# Altium project AXON-UPS.PrjPcb
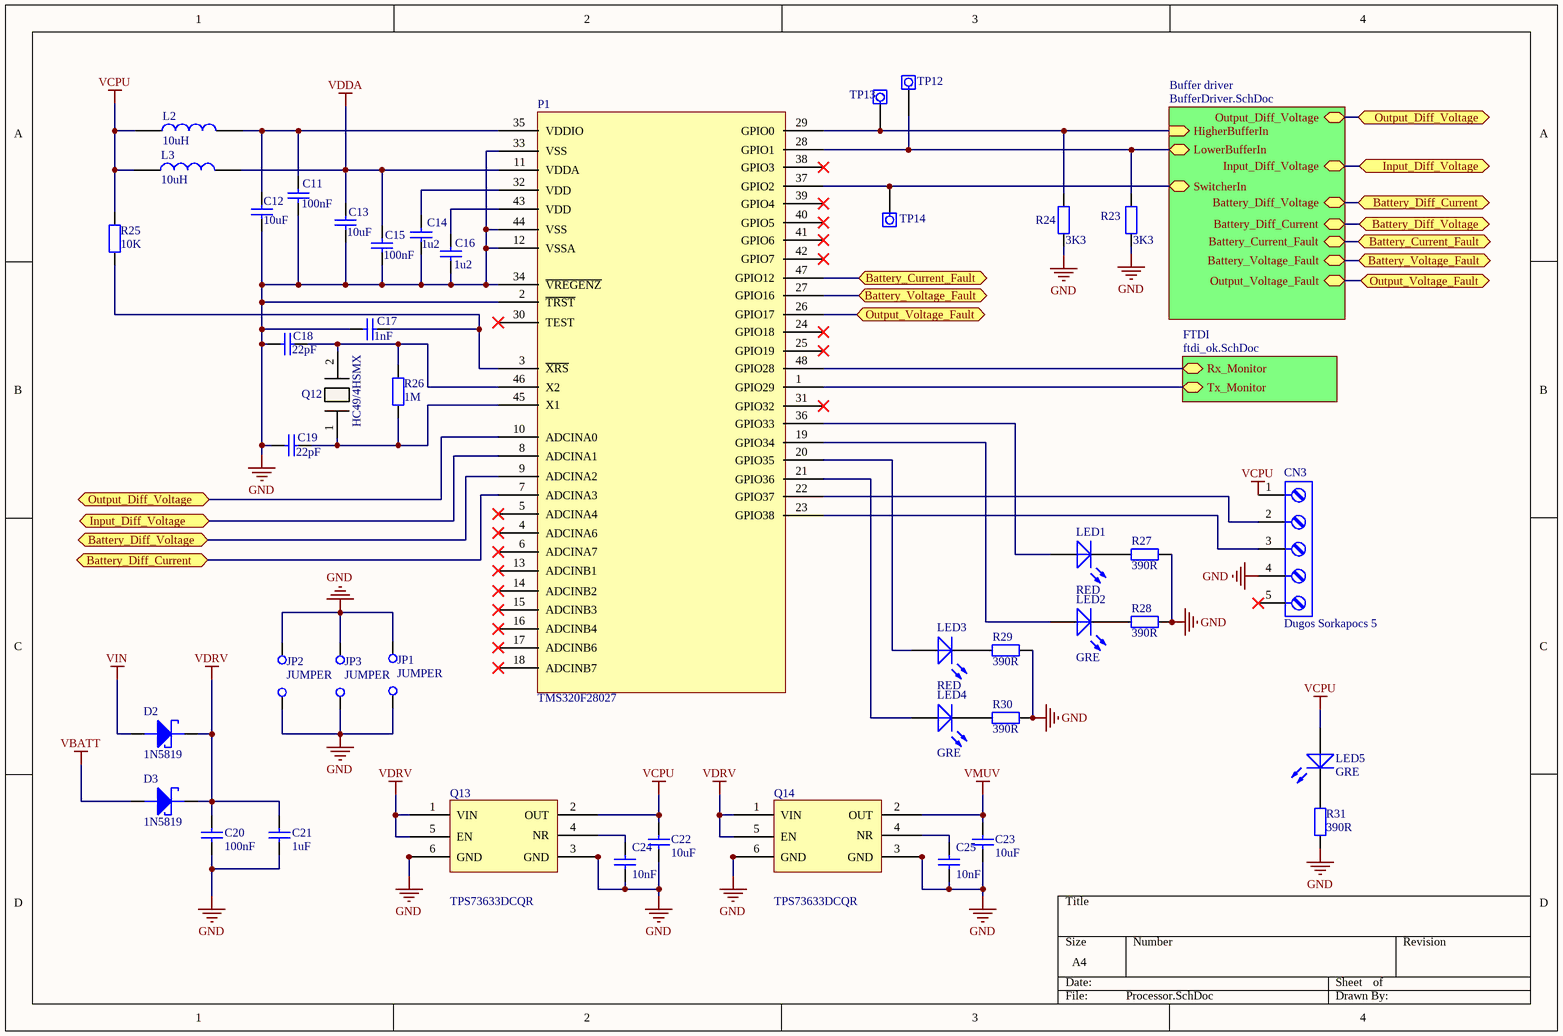
[diagram p0: Processor.SchDoc]
6 sheets, 186 parts. Net scope: hierarchical (ports join the sheet entries above them; power ports are global).
Board file: UPS.PcbDoc
Sheets:
  Processor.SchDoc
    Buffer driver = BufferDriver.SchDoc
      Fet meghajtó = FetController.SchDoc
        Főkör = UPS_controller.SchDoc
          Mérések = Measurements.SchDoc
    FTDI = ftdi_ok.SchDoc

## Sheet Processor.SchDoc
size A4; DocumentNumber: 4; SheetNumber: 4; SheetTotal: 6

### Parts
C11  100nF  [FP_0805_CAP_085]
C12  10uF  [FP_0805_CAP_085]
C13  10uF  [FP_0805_CAP_085]
C14  1u2  [FP_1206_CAP_125]
C15  100nF  [FP_0805_CAP_085]
C16  1u2  [FP_1206_CAP_125]
C17  1nF  [FP_0805_CAP_085]
C18  22pF  [FP_0805_CAP_085]
C19  22pF  [FP_0805_CAP_085]
C20  100nF  [FP_0805_CAP_085]
C21  1uF  [FP_0805_CAP_085]
C22  10uF  [FP_0805_CAP_085]
C23  10uF  [FP_0805_CAP_085]
C24  10nF  [FP_0805_CAP_085]
C25  10nF  [FP_0805_CAP_085]
CN3  Dugos Sorkapocs 5  [FP_CONN4_TUSKE_254MM]
D2  1N5819  [AXIAL-0.3]
D3  1N5819  [AXIAL-0.3]
JP1  JUMPER  [FP_CONN2_TUSKE_254MM]
JP2  JUMPER  [FP_CONN2_TUSKE_254MM]
JP3  JUMPER  [FP_CONN2_TUSKE_254MM]
L2  10uH  [AXIAL-0.3]
L3  10uH  [AXIAL-0.3]
LED1  RED  [FP_LED_TH_RED]
LED2  GRE  [FP_LED_TH_GREEN]
LED3  RED  [FP_LED_TH_RED]
LED4  GRE  [FP_LED_TH_GREEN]
LED5  GRE  [FP_LED_TH_GREEN]
P1  TMS320F28027  [S-PQFP48]
Q12  HC49/4HSMX  [Crystal_10MHz]
Q13  TPS73633DCQR  [TPS73633]
Q14  TPS73633DCQR  [TPS73633]
R23  3K3  [FP_0805_RES]
R24  3K3  [FP_0805_RES]
R25  10K  [FP_0805_RES]
R26  1M  [FP_0805_RES]
R27  390R  [AXIAL-0.3]
R28  390R  [AXIAL-0.3]
R29  390R  [AXIAL-0.3]
R30  390R  [AXIAL-0.3]
R31  390R  [AXIAL-0.3]
TP12  Testpoint  [TESTPOINT_1.5]  (value not drawn)  (no BOM)
TP13  Testpoint  [TESTPOINT_1.5]  (value not drawn)  (no BOM)
TP14  Testpoint  [TESTPOINT_1.5]  (value not drawn)  (no BOM)

### Sub-sheets
Buffer driver = BufferDriver.SchDoc: HigherBufferIn (in), LowerBufferIn (bidir), SwitcherIn, Output_Diff_Voltage, Input_Diff_Voltage, Battery_Diff_Voltage, Battery_Diff_Current, Battery_Current_Fault, Battery_Voltage_Fault, Output_Voltage_Fault
FTDI = ftdi_ok.SchDoc: Rx_Monitor, Tx_Monitor

### Ports
Battery_Current_Fault, Battery_Diff_Current, Battery_Diff_Voltage, Battery_Voltage_Fault, Input_Diff_Voltage, Output_Diff_Voltage, Output_Voltage_Fault

### Nets
GND: C11.1 C12.1 C13.1 C14.1 C15.2 C16.1 C17.1 C18.1 C19.1 C20.1 C21.1 C22.1 C23.1 C24.1 C25.1 CN3.4 JP1.1(C1) JP1.2(C2) JP2.1(C1) JP2.2(C2) JP3.1(C1) JP3.2(C2) P1.2(~{TRST}) P1.12(VSSA) P1.33(VSS) P1.34(~{VREGENZ}) P1.44(VSS) Q13.3(GND) Q13.6(GND) Q14.3(GND) Q14.6(GND) R23.2 R24.1 R27.1 R28.1 R29.1 R30.1 R31.1
VBATT: D3.2(ANODE)
VCPU: C22.2 CN3.1 L2.1 L3.1 LED5.1(A) Q13.2(OUT) R25.2
VDDA: C13.2 C15.1 L3.2 P1.11(VDDA)
VDRV: C20.2 C21.2 D2.1(CATHODE) D3.1(CATHODE) Q13.1(VIN) Q13.5(EN) Q14.1(VIN) Q14.5(EN)
VIN: D2.2(ANODE)
VMUV: C23.2 Q14.2(OUT)
NetC11_2: C11.2 C12.2 L2.2 P1.35(VDDIO)
NetC14_2: C14.2 P1.32(VDD)
NetC16_2: C16.2 P1.43(VDD)
NetC17_2: C17.2 P1.3(~{XRS}) R25.1
NetC18_2: C18.2 P1.46(X2) Q12.2(X2) R26.2
NetC19_2: C19.2 P1.45(X1) Q12.1(X1) R26.1
NetC24_2: C24.2 Q13.4(NR)
NetC25_2: C25.2 Q14.4(NR)
NetC40_2: P1.10(ADCINA0) ; port Output_Diff_Voltage, sheet Buffer driver/Output_Diff_Voltage
NetC41_2: P1.9(ADCINA2) ; port Battery_Diff_Voltage, sheet Buffer driver/Battery_Diff_Current
NetC50_2: P1.8(ADCINA1) ; port Input_Diff_Voltage, sheet Buffer driver/Input_Diff_Voltage
NetC51_2: P1.7(ADCINA3) ; port Battery_Diff_Current, sheet Buffer driver/Battery_Diff_Voltage
NetCN3_2: CN3.2 P1.22(GPIO37)
NetCN3_3: CN3.3 P1.23(GPIO38)
NetLED1_1: LED1.1(A) P1.36(GPIO33)
NetLED1_2: LED1.2(K) R27.2
NetLED2_1: LED2.1(A) P1.19(GPIO34)
NetLED2_2: LED2.2(K) R28.2
NetLED3_1: LED3.1(A) P1.20(GPIO35)
NetLED3_2: LED3.2(K) R29.2
NetLED4_1: LED4.1(A) P1.21(GPIO36)
NetLED4_2: LED4.2(K) R30.2
NetLED5_2: LED5.2(K) R31.2
NetP1_1: P1.1(GPIO29) ; sheet FTDI/Tx_Monitor
NetP1_26: P1.26(GPIO17) ; port Output_Voltage_Fault, sheet Buffer driver/Output_Voltage_Fault
NetP1_27: P1.27(GPIO16) ; port Battery_Voltage_Fault, sheet Buffer driver/Battery_Voltage_Fault
NetP1_28: P1.28(GPIO1) R23.1 TP12.1 ; sheet Buffer driver/LowerBufferIn
NetP1_29: P1.29(GPIO0) R24.2 TP13.1 ; sheet Buffer driver/HigherBufferIn
NetP1_37: P1.37(GPIO2) TP14.1 ; sheet Buffer driver/SwitcherIn
NetP1_47: P1.47(GPIO12) ; port Battery_Current_Fault, sheet Buffer driver/Battery_Current_Fault
NetP1_48: P1.48(GPIO28) ; sheet FTDI/Rx_Monitor

Not connected (* = marked no-connect by the designer): CN3 5*; P1 4(ADCINA6)* 5(ADCINA4)* 6(ADCINA7)* 13(ADCINB1)* 14(ADCINB2)* 15(ADCINB3)* 16(ADCINB4)* 17(ADCINB6)* 18(ADCINB7)* 24(GPIO18)* 25(GPIO19)* 30(TEST)* 31(GPIO32)* 38(GPIO3)* 39(GPIO4)* 40(GPIO5)* 41(GPIO6)* 42(GPIO7)*

### Library data of the parts
C11-C25 = CAP: Capacitor
  C11 C15 C20: Value: 100nF; Lomex NR: 82-07-32
  C12 C13 C22 C23: Value: 10uF; Lomex NR: 82-08-32
  C14 C16: Value: 1u2; Lomex NR: 82-05-93
  C17: Value: 1nF; Lomex NR: 82-00-75
  C18 C19: Value: 22pF; Lomex NR: 82-09-18
  C21: Value: 1uF; Lomex NR: 82-05-11
  C24 C25: Value: 10nF; Lomex NR: 82-05-66
CN3 = Dugos Sorkapocs 5: SORKAPOCS 5 P RM5.08 CSAPSORLÉC 90° ZÁRT 12A; Part Class: Connector; K_manufacturer: (STE); Order Code: 43-07-79, 43-07-78; CompType: CPM5.08/5SQ, CPF5.08/5; Value: 5P; Distributor: Lomex; Package: RM5.08
D2 D3 = SCHOTTKY: NXP - PMEG3020EJ,115 - SCHOTTKY RECT 30V 2A SOD323F; Supplier: 16-04-12; Type: 1N5819
JP1-JP3 = JUMPER: Jumper Wire; Supplier: Farnell 1668537×1/6
L2 L3 = IND: Inductor; Value: 10uH; Lomex NR: 55-00-65
LED1 LED3 = LED: Part Class: Semiconductor; K_Manufacturer: Kingbright; CompType: KP-3216SRD-PRV; Distributor: Lomex; Order Code: 95-00-28; Package: 1206; Value: RED
LED2 LED4 LED5 = LED: Part Class: Semiconductor; K_Manufacturer: Kingbright; CompType: KP-3216SGD; Distributor: Lomex; Order Code: 95-00-26; Package: 1206; Value: GRE
P1 = TMS320F28027: Processor
Q12 = HC49/4HSMX: kristály
Q13 Q14 = TPS73633DCQR: proci táp 3V3
R23-R26 = RES: Resistor
  R23 R24: Value: 3K3
  R25: Value: 10K
  R26: Value: 1M
R27-R31 = Resistor: K_Manufacturer: Viking Tech Corp.; CompType: CR-05JL7--390R; Distributor: Lomex; Order Code: 81-10-82; Package: 0805; Part Class: Resistor; Value: 390R
TP12-TP14 = Testpoint: Part Class: Connector

## Sheet BufferDriver.SchDoc
size A4; DocumentNumber: 3; SheetNumber: 3; SheetTotal: 6
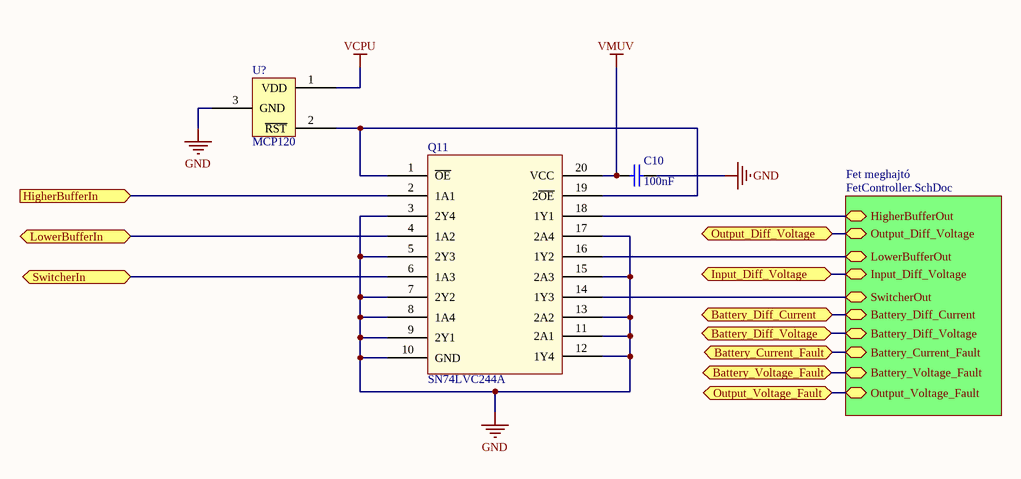
[diagram p1: BufferDriver.SchDoc]

### Parts
C10  100nF  [FP_0805_CAP_085]
Q11  SN74LVC244A  [SOP20]
U?  MCP120  [SOT-23 - 3]

### Sub-sheets
Fet meghajtó = FetController.SchDoc: HigherBufferOut, LowerBufferOut, SwitcherOut, Output_Diff_Voltage, Input_Diff_Voltage, Battery_Diff_Voltage, Battery_Diff_Current, Battery_Current_Fault, Battery_Voltage_Fault, Output_Voltage_Fault

### Ports
Battery_Current_Fault, Battery_Diff_Current, Battery_Diff_Voltage, Battery_Voltage_Fault, HigherBufferIn (in), Input_Diff_Voltage, LowerBufferIn (bidir), Output_Diff_Voltage, Output_Voltage_Fault, SwitcherIn

### Nets
GND: C10.1 Q11.3(2Y4) Q11.5(2Y3) Q11.7(2Y2) Q11.8(1A4) Q11.9(2Y1) Q11.10(GND) Q11.11(2A1) Q11.12(1Y4) Q11.13(2A2) Q11.15(2A3) Q11.17(2A4) U?.3(GND)
VCPU: U?.1(VDD)
VMUV: C10.2 Q11.20(VCC)
NetC40_2: port Output_Diff_Voltage, sheet Fet meghajtó/Output_Diff_Voltage
NetC41_2: port Battery_Diff_Current, sheet Fet meghajtó/Battery_Diff_Current
NetC50_2: port Input_Diff_Voltage, sheet Fet meghajtó/Input_Diff_Voltage
NetC51_2: port Battery_Diff_Voltage, sheet Fet meghajtó/Battery_Diff_Voltage
NetP1_26: port Output_Voltage_Fault, sheet Fet meghajtó/Output_Voltage_Fault
NetP1_27: port Battery_Voltage_Fault, sheet Fet meghajtó/Battery_Voltage_Fault
NetP1_28: Q11.4(1A2) ; port LowerBufferIn
NetP1_29: Q11.2(1A1) ; port HigherBufferIn
NetP1_37: Q11.6(1A3) ; port SwitcherIn
NetP1_47: port Battery_Current_Fault, sheet Fet meghajtó/Battery_Current_Fault
NetQ11_1: Q11.1(~{OE}) Q11.19(2~{OE}) U?.2(~{RST})
NetQ11_14: Q11.14(1Y3) ; sheet Fet meghajtó/SwitcherOut
NetQ11_16: Q11.16(1Y2) ; sheet Fet meghajtó/LowerBufferOut
NetQ11_18: Q11.18(1Y1) ; sheet Fet meghajtó/HigherBufferOut

### Library data of the parts
C10 = CAP: Capacitor; Value: 100nF; Lomex NR: 82-07-32
U? = MCP120: Voltage detector

## Sheet FetController.SchDoc
size A4; DocumentNumber: 2; SheetNumber: 2; SheetTotal: 6
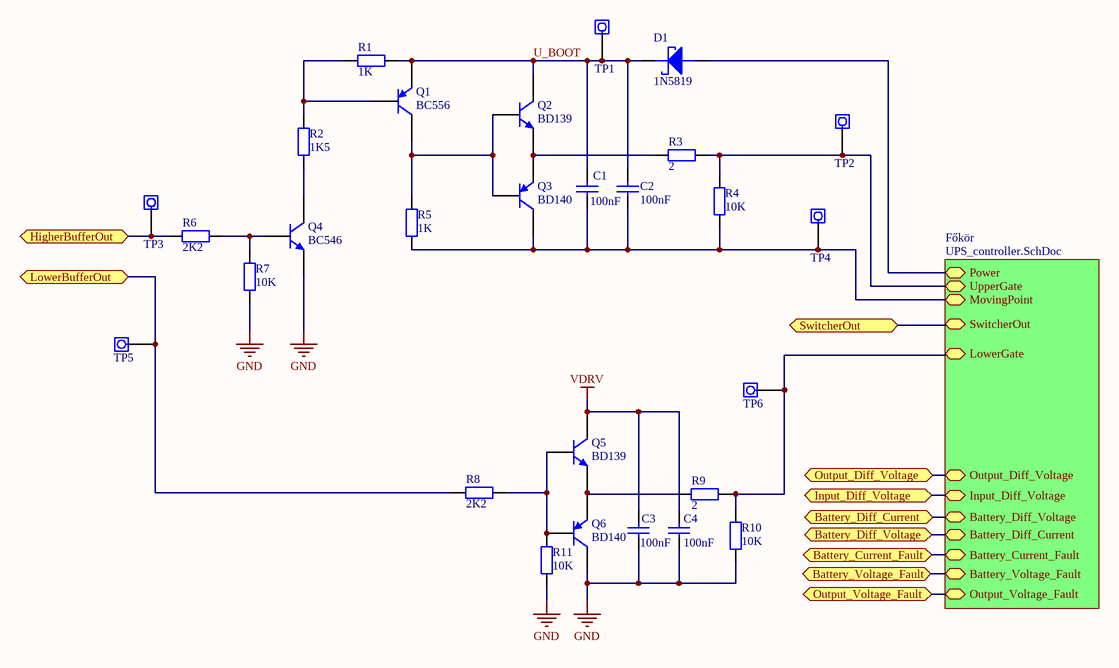
[diagram p2: FetController.SchDoc]

### Parts
C1  100nF  [FP_0805_CAP_085]
C2  100nF  [FP_0805_CAP_085]
C3  100nF  [FP_0805_CAP_085]
C4  100nF  [FP_0805_CAP_085]
D1  1N5819  [AXIAL-0.3]
Q1  BC556  [TO-92]
Q2  BD139  [TO-32]
Q3  BD140  [TO-32]
Q4  BC546  [TO-92]
Q5  BD139  [TO-32]
Q6  BD140  [TO-32]
R1  1K  [AXIAL-0.3]
R2  1K5  [AXIAL-0.3]
R3  2  [AXIAL-0.3]
R4  10K  [AXIAL-0.3]
R5  1K  [AXIAL-0.3]
R6  2K2  [AXIAL-0.3]
R7  10K  [AXIAL-0.3]
R8  2K2  [AXIAL-0.3]
R9  2  [AXIAL-0.3]
R10  10K  [AXIAL-0.3]
R11  10K  [AXIAL-0.3]
TP1  Testpoint  [TESTPOINT_1.5]  (value not drawn)  (no BOM)
TP2  Testpoint  [TESTPOINT_1.5]  (value not drawn)  (no BOM)
TP3  Testpoint  [TESTPOINT_1.5]  (value not drawn)  (no BOM)
TP4  Testpoint  [TESTPOINT_1.5]  (value not drawn)  (no BOM)
TP5  Testpoint  [TESTPOINT_1.5]  (value not drawn)  (no BOM)
TP6  Testpoint  [TESTPOINT_1.5]  (value not drawn)  (no BOM)

### Sub-sheets
Főkör = UPS_controller.SchDoc: Power, MovingPoint, UpperGate, LowerGate, SwitcherOut, Output_Diff_Voltage, Input_Diff_Voltage, Battery_Diff_Voltage, Battery_Diff_Current, Battery_Current_Fault, Battery_Voltage_Fault, Output_Voltage_Fault

### Ports
Battery_Current_Fault, Battery_Diff_Current, Battery_Diff_Voltage, Battery_Voltage_Fault, HigherBufferOut, Input_Diff_Voltage, LowerBufferOut, Output_Diff_Voltage, Output_Voltage_Fault, SwitcherOut

### Nets
GND: C3.1 C4.1 Q4.3(E) Q6.2(C) R7.1 R10.1 R11.1
VDRV: C3.2 C4.2 Q5.2(C)
U_BOOT: C1.2 C2.2 D1.1(CATHODE) Q1.3(E) Q2.2(C) R1.1 TP1.1
NetC1_1: C1.1 C2.1 Q3.2(C) R4.1 R5.1 TP4.1 ; sheet Főkör/MovingPoint
NetC7_1: D1.2(ANODE) ; sheet Főkör/Power
NetC40_2: port Output_Diff_Voltage, sheet Főkör/Output_Diff_Voltage
NetC41_2: port Battery_Diff_Current, sheet Főkör/Battery_Diff_Voltage
NetC50_2: port Input_Diff_Voltage, sheet Főkör/Input_Diff_Voltage
NetC51_2: port Battery_Diff_Voltage, sheet Főkör/Battery_Diff_Current
NetP1_26: port Output_Voltage_Fault, sheet Főkör/Output_Voltage_Fault
NetP1_27: port Battery_Voltage_Fault, sheet Főkör/Battery_Voltage_Fault
NetP1_47: port Battery_Current_Fault, sheet Főkör/Battery_Current_Fault
NetQ1_1: Q1.1(C) Q2.3(B) Q3.1(B) R5.2
NetQ1_2: Q1.2(B) R1.2 R2.2
NetQ2_1: Q2.1(E) Q3.3(E) R3.1
NetQ4_1: Q4.1(C) R2.1
NetQ4_2: Q4.2(B) R6.1 R7.2
NetQ5_1: Q5.1(E) Q6.3(E) R9.1
NetQ5_3: Q5.3(B) Q6.1(B) R8.1 R11.2
NetQ9_1: R3.2 R4.2 TP2.1 ; sheet Főkör/UpperGate
NetQ10_1: R9.2 R10.2 TP6.1 ; sheet Főkör/LowerGate
NetQ11_14: port SwitcherOut, sheet Főkör/SwitcherOut
NetQ11_16: R8.2 TP5.1 ; port LowerBufferOut
NetQ11_18: R6.2 TP3.1 ; port HigherBufferOut

### Library data of the parts
C1-C4 = CAP: Capacitor; Value: 100nF; Lomex NR: 82-07-32
D1 = SCHOTTKY: as D2 on sheet Processor; Supplier: 16-04-12; Type: 1N5819
Q1 = BC556: PNP tranzisztor; Lomex NR: 21-06-74
Q2 Q5 = BD139: NPN tranzisztor; Lomex NR: 21-11-08
Q3 Q6 = BD140: PNP tranzisztor; Lomex NR: 21-11-09
Q4 = BC546: NPN tranzisztor; Lomex NR: 21-11-18
R1-R11 = RES: Resistor
  R1 R5: Value: 1K
  R2: Value: 1K5
  R3 R9: Value: 2
  R4 R7 R10 R11: Value: 10K
  R6 R8: Value: 2K2
TP1-TP6 = Testpoint: Part Class: Connector

## Sheet UPS_controller.SchDoc
size A4; DocumentNumber: 1; SheetNumber: 1; SheetTotal: 6
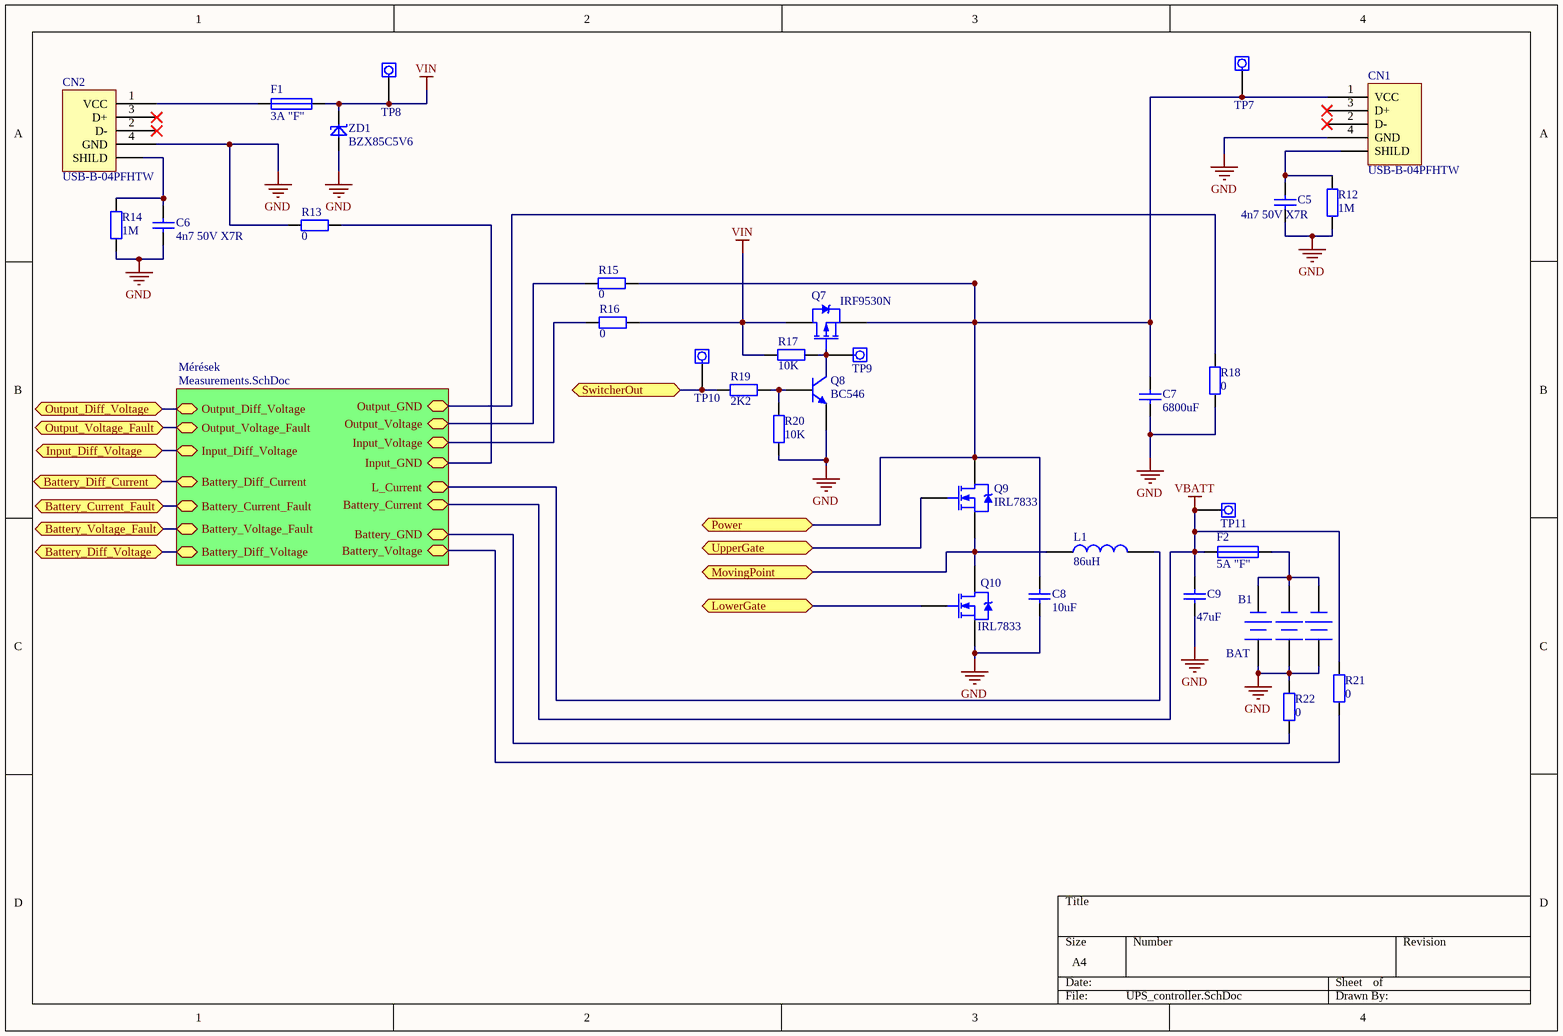
[diagram p3: UPS_controller.SchDoc]

### Parts
B1  BAT  [Elemtarto_3rekesz]
C5  4n7 50V X7R  [0805_C]
C6  4n7 50V X7R  [0805_C]
C7  value 6800uF  [ELKO RM10.16 d=2]  (hidden comment: 5600uF)
C8  10uF  [FP_0805_CAP_085]
C9  47uF  [FP_1206_CAP_125]
CN1  USB-B-04PFHTW  [USB-B]
CN2  USB-B-04PFHTW  [USB-B]
F1  3A "F"  [BIZTOSITO_5X20]
F2  5A "F"  [BIZTOSITO_5X20]
L1  86uH  [toroid]
Q7  IRF9530N  [TO-220-AB]
Q8  BC546  [TO-92]
Q9  IRL7833  [TO-220-AB]
Q10  IRL7833  [TO-220-AB]
R12  1M  [FP_0805_RES]
R13  0  [FP_0805_0ohm]
R14  1M  [FP_0805_RES]
R15  0  [FP_0805_0ohm]
R16  0  [FP_0805_0ohm]
R17  10K  [AXIAL-0.3]
R18  0  [FP_0805_0ohm]
R19  2K2  [AXIAL-0.3]
R20  10K  [AXIAL-0.3]
R21  0  [FP_0805_0ohm]
R22  0  [FP_0805_0ohm]
TP7  Testpoint  [TESTPOINT_1.5]  (value not drawn)
TP8  Testpoint  [TESTPOINT_1.5]  (value not drawn)
TP9  Testpoint  [TESTPOINT_1.5]  (value not drawn)
TP10  Testpoint  [TESTPOINT_1.5]  (value not drawn)
TP11  Testpoint  [TESTPOINT_1.5]  (value not drawn)
ZD1  BZX85C5V6  [DO-41-400]

### Sub-sheets
Mérések = Measurements.SchDoc: Output_Voltage, Output_GND, Input_Voltage, Battery_Voltage, Battery_GND, L_Current, Battery_Current, Input_GND, Output_Diff_Voltage, Input_Diff_Voltage, Battery_Diff_Voltage, Battery_Diff_Current, Battery_Current_Fault, Battery_Voltage_Fault, Output_Voltage_Fault

### Ports
Battery_Current_Fault, Battery_Diff_Current, Battery_Diff_Voltage, Battery_Voltage_Fault, Input_Diff_Voltage, LowerGate, MovingPoint, Output_Diff_Voltage, Output_Voltage_Fault, Power, SwitcherOut, UpperGate

### Nets
GND: B1.1(GND) B1.2(GND) B1.3(GND) C5.2 C6.2 C7.2 C8.1 C9.1 CN1.4(GND) CN2.4(GND) Q8.3(E) Q10.3(S) R12.1 R13.1 R14.1 R18.1 R20.1 R22.1 ZD1.1(A)
VBATT: C9.2 F2.2 R21.1 TP11.1 ; sheet Mérések/Battery_Current
VIN: F1.1 Q7.2(D) R16.2 R17.2 TP8.1 ZD1.2(K)
NetB1_4: B1.4(VCC) B1.5(VCC) B1.6(VCC) F2.1
NetC1_1: L1.1 Q9.3(S) Q10.2(D) ; port MovingPoint
NetC5_1: C5.1 CN1.0(SHILD) R12.2
NetC6_1: C6.1 CN2.0(SHILD) R14.2
NetC7_1: C7.1 C8.2 CN1.1(VCC) Q7.3(S) Q9.2(D) R15.2 TP7.1 ; port Power
NetC40_2: port Output_Diff_Voltage, sheet Mérések/Output_Diff_Voltage
NetC41_2: port Battery_Diff_Voltage, sheet Mérések/Battery_Diff_Voltage
NetC50_2: port Input_Diff_Voltage, sheet Mérések/Input_Diff_Voltage
NetC51_2: port Battery_Diff_Current, sheet Mérések/Battery_Diff_Current
NetCN2_1: CN2.1(VCC) F1.2
NetL1_2: L1.2 ; sheet Mérések/L_Current
NetP1_26: port Output_Voltage_Fault, sheet Mérések/Output_Voltage_Fault
NetP1_27: port Battery_Voltage_Fault, sheet Mérések/Battery_Voltage_Fault
NetP1_47: port Battery_Current_Fault, sheet Mérések/Battery_Current_Fault
NetQ7_1: Q7.1(G) Q8.1(C) R17.1 TP9.1
NetQ8_2: Q8.2(B) R19.2 R20.2
NetQ9_1: Q9.1(G) ; port UpperGate
NetQ10_1: Q10.1(G) ; port LowerGate
NetQ11_14: R19.1 TP10.1 ; port SwitcherOut
NetR13_2: R13.2 ; sheet Mérések/Input_GND
NetR15_1: R15.1 ; sheet Mérések/Output_Voltage
NetR16_1: R16.1 ; sheet Mérések/Input_Voltage
NetR18_2: R18.2 ; sheet Mérések/Output_GND
NetR21_2: R21.2 ; sheet Mérések/Battery_Voltage
NetR22_2: R22.2 ; sheet Mérések/Battery_GND

Not connected (* = marked no-connect by the designer): CN1 2(D-)* 3(D+)*; CN2 2(D-)* 3(D+)*

### Library data of the parts
C5 C6 = Capacitor_SMD: SMD kondenzátorok; CompType: CC0805KRX7R9BB472; Distributor: Lomex; Order Code: 82-00-71; Package: 0805; Part Class: Capacitor; Value: 4n7 50V X7R
C7 = CAP: Capacitor; Voltage: 16V; Supplier: Yageo
C8 = CAP: Capacitor; Voltage: 6.3V; Supplier: X5R CL10A106MQ8NNNC; Value: 10uF; Lomex NR: 82-08-32
C9 = CAP: Capacitor; Voltage: 6V3; Value: 47uF; Supplier: X5R CL31A476MQHNNNE; Lomex NR: 82-08-04
CN1 CN2 = USB-B: Part Class: Connector; Note: HORIZONTAL PCB FEMALE NYÁK 90°; Distributor: Lomex; Order Code: 43-14-75; Package: USB-B 4P ANYA 90°; Price: 80; CompType: USB-B-04PFHTW
F1 F2 = Fuse: Part Class: Other; Order Code: 44-01-84, 44-01-85, 44-00-57; CompType: PTF/15, BS/140NA,; Note: BIZTOSITÉK FOGL.  (STE) (503.300) 5x20 + fedél (503.310) + bizt.; Distributor: Lomex
  F1: Value: 3A "F"
  F2: Value: 5A "F"
L1 = IND: Inductor; Value: 86uH
Q7 = IRF9530N: P-MOSFET; Lomex NR: 21-01-94
Q8 = BC546: NPN tranzisztor; Lomex NR: 21-11-18
Q9 Q10 = IRL7833: N-FET; Lomex NR: 82-07-81
R12-R22 = RES: Resistor
  R12 R14: Value: 1M
  R13 R15 R16 R18 R21 R22: Value: 0
  R17 R20: Value: 10K
  R19: Value: 2K2
TP7-TP11 = Testpoint: Part Class: Connector
ZD1 = BZX85C5V6: Zener Diode 5V6 1.3W DO-41; Part Class: Semiconductor; K_Manufacturer: (VIS); Note: 5.6 V 1.3 W; Distributor: Lomex; Order Code: 18-01-92; Package: DO-41; CompType: BZX85C5V6

## Sheet Measurements.SchDoc
size A3; DocumentNumber: 6; SheetNumber: 6; SheetTotal: 6
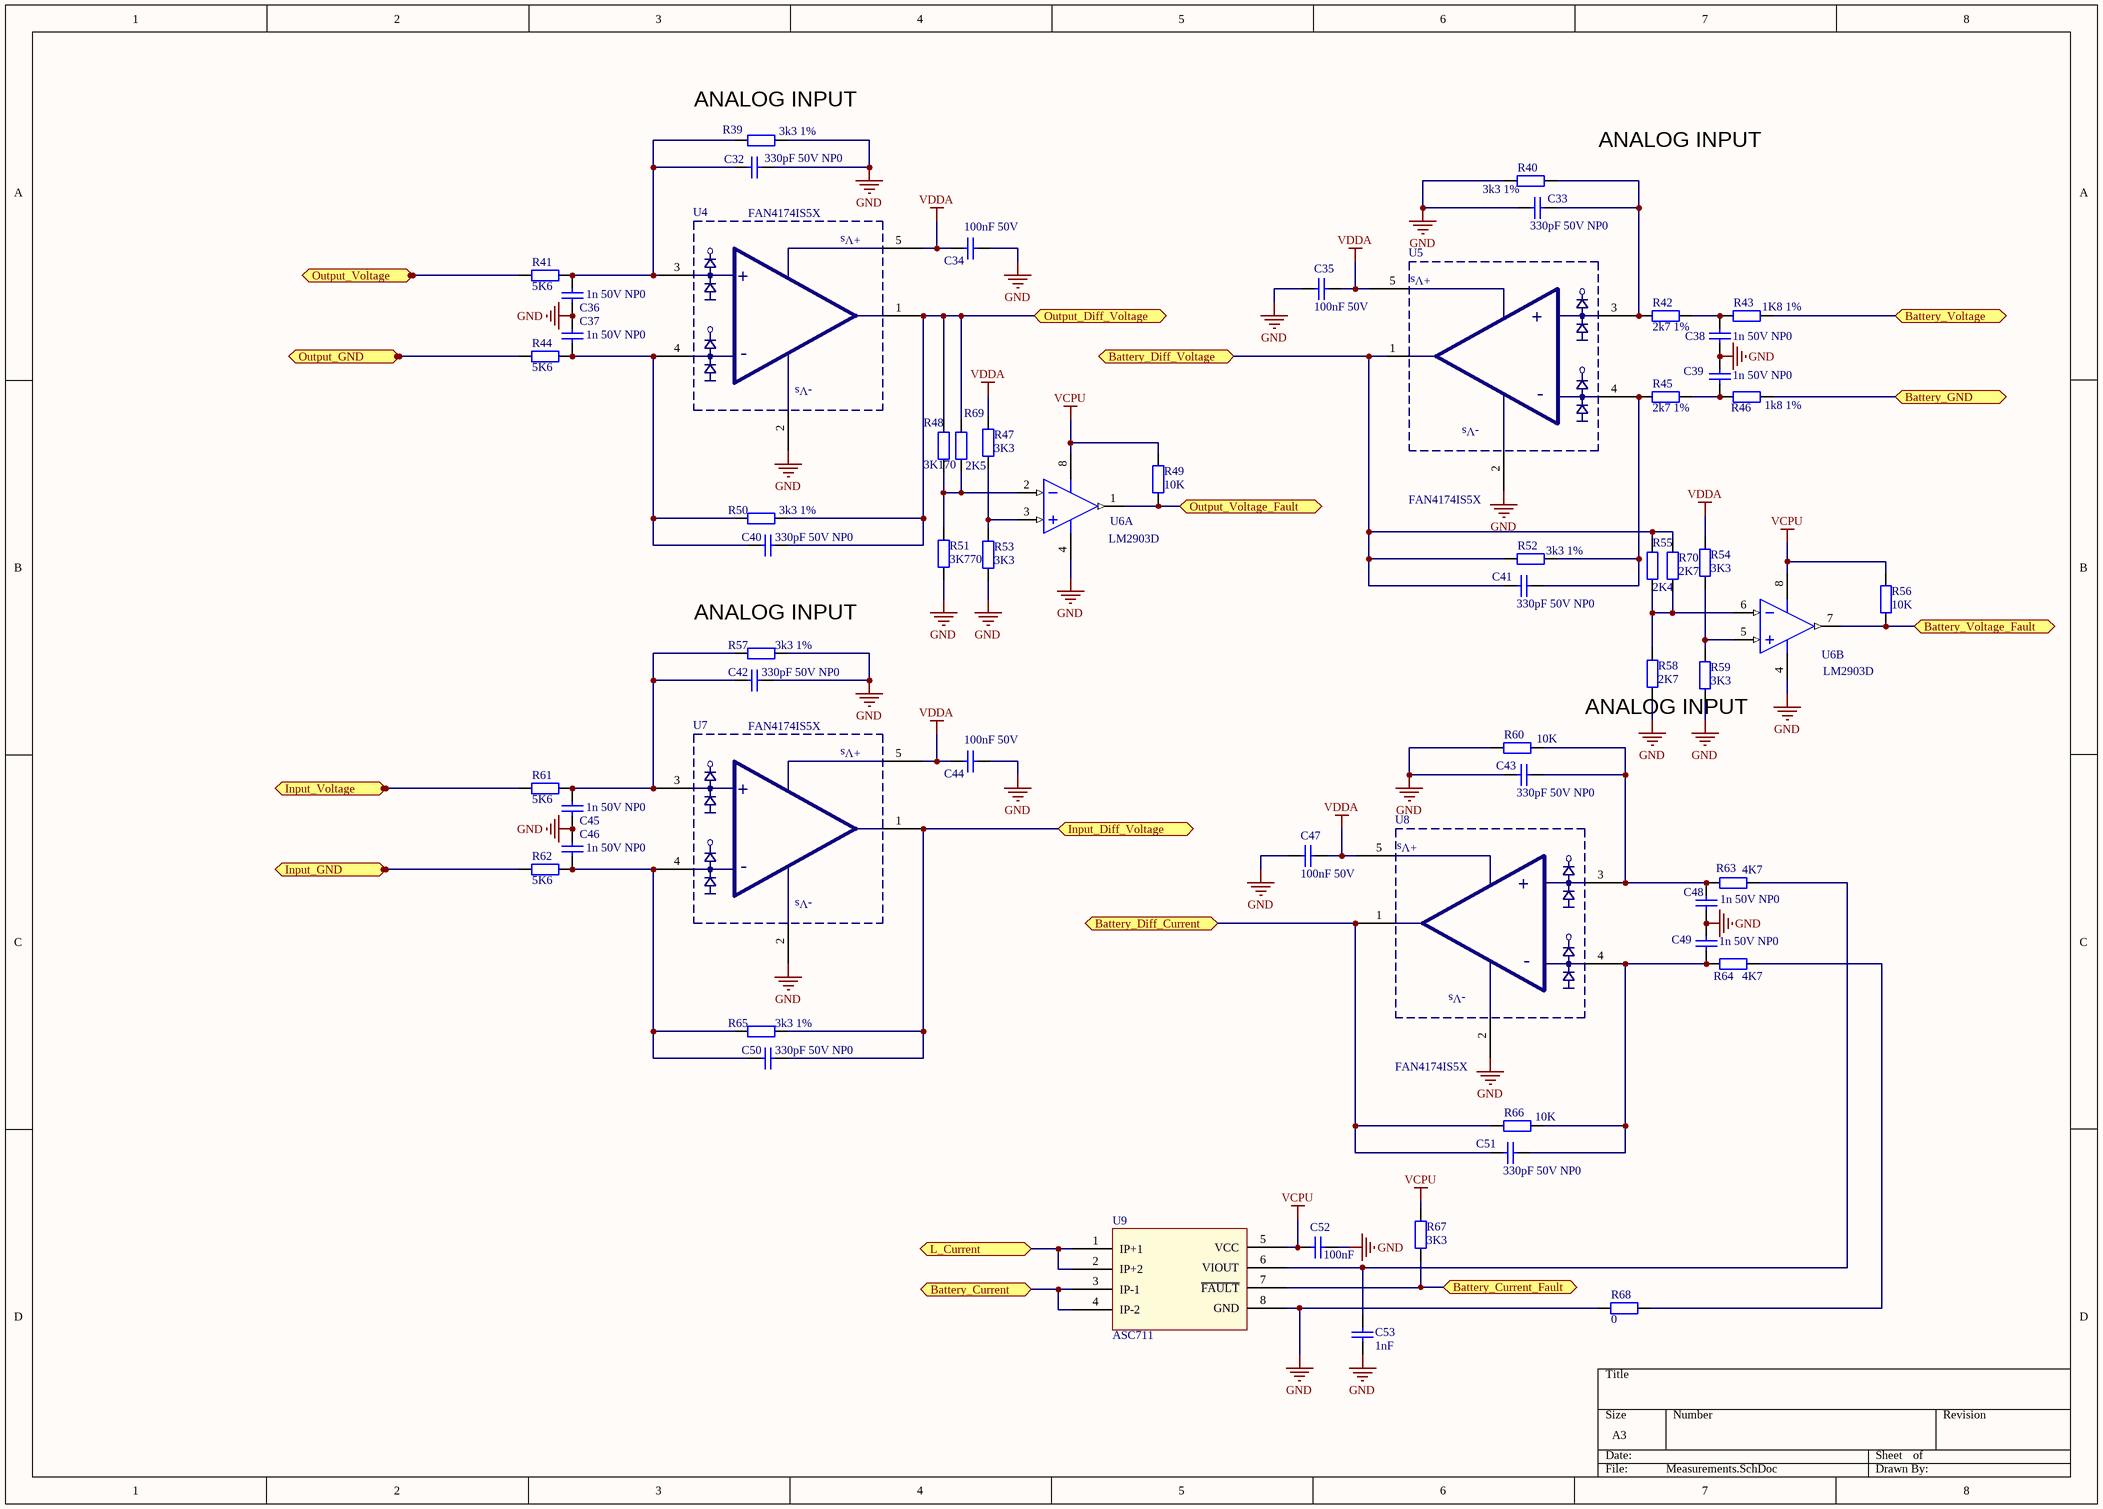
[diagram p4: Measurements.SchDoc]

### Parts
C32  330pF 50V NP0  [0805_C]
C33  330pF 50V NP0  [0805_C]
C34  100nF 50V  [0805_C]
C35  100nF 50V  [0805_C]
C36  1n 50V NP0  [FP_0805_CAP_085]
C37  1n 50V NP0  [FP_0805_CAP_085]
C38  1n 50V NP0  [FP_0805_CAP_085]
C39  1n 50V NP0  [FP_0805_CAP_085]
C40  330pF 50V NP0  [0805_C]
C41  330pF 50V NP0  [0805_C]
C42  330pF 50V NP0  [0805_C]
C43  330pF 50V NP0  [0805_C]
C44  100nF 50V  [0805_C]
C45  1n 50V NP0  [FP_0805_CAP_085]
C46  1n 50V NP0  [FP_0805_CAP_085]
C47  100nF 50V  [0805_C]
C48  1n 50V NP0  [FP_0805_CAP_085]
C49  1n 50V NP0  [FP_0805_CAP_085]
C50  330pF 50V NP0  [0805_C]
C51  330pF 50V NP0  [0805_C]
C52  100nF  [FP_0805_CAP_085]
C53  1nF  [FP_0805_CAP_085]
R39  3k3 1%  [FP_0805_RES]
R40  3k3 1%  [FP_0805_RES]
R41  5K6  [FP_0805_RES]
R42  2k7 1%  [FP_0805_RES]
R43  1K8 1%  [FP_0805_RES]
R44  5K6  [FP_0805_RES]
R45  2k7 1%  [FP_0805_RES]
R46  1k8 1%  [FP_0805_RES]
R47  3K3  [FP_0805_RES]
R48  3K170  [FP_0805_RES]
R49  10K  [FP_0805_RES]
R50  3k3 1%  [FP_0805_RES]
R51  3K770  [FP_0805_RES]
R52  3k3 1%  [FP_0805_RES]
R53  3K3  [FP_0805_RES]
R54  3K3  [FP_0805_RES]
R55  2K4  [FP_0805_RES]
R56  10K  [FP_0805_RES]
R57  3k3 1%  [FP_0805_RES]
R58  2K7  [FP_0805_RES]
R59  3K3  [FP_0805_RES]
R60  10K  [FP_0805_RES]
R61  5K6  [FP_0805_RES]
R62  5K6  [FP_0805_RES]
R63  4K7  [FP_0805_RES]
R64  4K7  [FP_0805_RES]
R65  3k3 1%  [FP_0805_RES]
R66  10K  [FP_0805_RES]
R67  3K3  [FP_0805_RES]
R68  0  [FP_0805_0ohm]
R69  2K5  [FP_0805_RES]
R70  2K7  [FP_0805_RES]
U4  FAN4174IS5X  [SOT-23-5]
U5  FAN4174IS5X  [SOT-23-5]
U6  LM2903D  [FP_SO8_MS012AA]  (parts A,B of 2)
U7  FAN4174IS5X  [SOT-23-5]
U8  FAN4174IS5X  [SOT-23-5]
U9  ASC711  [SOP8]

### Ports
Battery_Current, Battery_Current_Fault, Battery_Diff_Current, Battery_Diff_Voltage, Battery_GND, Battery_Voltage, Battery_Voltage_Fault, Input_Diff_Voltage, Input_GND, Input_Voltage, L_Current, Output_Diff_Voltage, Output_GND, Output_Voltage, Output_Voltage_Fault

### Nets
GND: C32.2 C33.2 C34.1 C35.1 C36.1 C37.2 C38.1 C39.2 C42.2 C43.2 C44.1 C45.1 C46.2 C47.1 C48.1 C49.2 C52.2 C53.1 R39.1 R40.1 R51.1 R53.1 R57.1 R58.1 R59.1 R60.1 R68.1 U4.2(-Vs) U5.2(-Vs) U6.4(GND) U7.2(-Vs) U8.2(-Vs) U9.8(GND)
VBATT: U9.3(IP-1) U9.4(IP-2) ; port Battery_Current
VCPU: C52.1 R49.2 R56.2 R67.2 U6.8(VCC) U9.5(VCC)
VDDA: C34.2 C35.2 C44.2 C47.2 R47.2 R54.2 U4.5(+Vs) U5.5(+Vs) U7.5(+Vs) U8.5(+Vs)
NetC32_1: C32.1 C36.2 R39.2 R41.2 U4.3(+IN)
NetC33_1: C33.1 R40.2 R42.1 U5.3(+IN)
NetC37_1: C37.1 C40.1 R44.2 R50.2 U4.4(-IN)
NetC38_2: C38.2 R42.2 R43.1
NetC39_1: C39.1 R45.2 R46.1
NetC40_2: C40.2 R48.2 R50.1 R69.2 U4.1(OUT) ; port Output_Diff_Voltage
NetC41_1: C41.1 R45.1 R52.2 U5.4(-IN)
NetC41_2: C41.2 R52.1 R55.2 R70.2 U5.1(OUT) ; port Battery_Diff_Voltage
NetC42_1: C42.1 C45.2 R57.2 R61.2 U7.3(+IN)
NetC43_1: C43.1 C48.2 R60.2 R63.1 U8.3(+IN)
NetC46_1: C46.1 C50.1 R62.2 R65.2 U7.4(-IN)
NetC49_1: C49.1 C51.1 R64.1 R66.2 U8.4(-IN)
NetC50_2: C50.2 R65.1 U7.1(OUT) ; port Input_Diff_Voltage
NetC51_2: C51.2 R66.1 U8.1(OUT) ; port Battery_Diff_Current
NetC53_2: C53.2 R63.2 U9.6(VIOUT)
NetL1_2: U9.1(IP+1) U9.2(IP+2) ; port L_Current
NetP1_26: R49.1 U6.1(OUT1) ; port Output_Voltage_Fault
NetP1_27: R56.1 U6.7(OUT2) ; port Battery_Voltage_Fault
NetP1_47: R67.1 U9.7(~{FAULT}) ; port Battery_Current_Fault
NetR13_2: R62.1 ; port Input_GND
NetR15_1: R41.1 ; port Output_Voltage
NetR16_1: R61.1 ; port Input_Voltage
NetR18_2: R44.1 ; port Output_GND
NetR21_2: R43.2 ; port Battery_Voltage
NetR22_2: R46.2 ; port Battery_GND
NetR47_1: R47.1 R53.2 U6.3(IN1+)
NetR48_1: R48.1 R51.2 R69.1 U6.2(IN1-)
NetR54_1: R54.1 R59.2 U6.5(IN2+)
NetR55_1: R55.1 R58.2 R70.1 U6.6(IN2-)
NetR64_2: R64.2 R68.2

### Notes on the sheet
- (near R39) ANALOG INPUT
- (near R40) ANALOG INPUT
- (near R57) ANALOG INPUT
- (near R60) ANALOG INPUT
- (in symbol FAN4174IS5X) +; -

### Library data of the parts
C32 C33 C40-C43 C50 C51 = Capacitor_SMD: SMD kondenzátorok; CompType: CC0805JRNP09BN331; Distributor: Lomex; Order Code: 82-01-07; Package: 0805; Part Class: Capacitor; Value: 330pF 50V NP0
C34 C35 C44 C47 = Capacitor_SMD: SMD kondenzátorok; CompType: CC0805KPX7R9BB104; Note: 10% X7R; Distributor: Lomex; Order Code: 82-07-32; Package: 0805; Part Class: Capacitor; Value: 100nF 50V
C36-C39 C45 C46 C48 C49 = Capacitor: CompType: CC0805JRNP09BN102; Distributor: Lomex; Order Code: 82-01-13; Package: 0805; Part Class: Capacitor; Value: 1n 50V NP0
C52 C53 = CAP: Capacitor
  C52: Value: 100nF; Lomex NR: 82-07-32
  C53: Value: 1nF
R39 R40 R50 R52 R57 R60 R65 R66 = Resistor: CompType: CR-05FL7---3K3; Distributor: Lomex; Order Code: 80-10-92; Package: 0805; Part Class: Resistor
  R39 R40 R50 R52 R57 R65: Value: 3k3 1%
  R60 R66: Value: 10K
R41 R44 R47-R49 R51 R53-R56 R58 R59 R61-R64 R67-R70 = RES: Resistor
  R41 R44 R61 R62: Value: 5K6
  R47 R53 R54 R59 R67: Value: 3K3
  R48: Value: 3K170
  R49 R56: Value: 10K
  R51: Value: 3K770
  R55: Value: 2K4
  R58 R70: Value: 2K7
  R63 R64: Value: 4K7
  R68: Value: 0
  R69: Value: 2K5
R42 R45 = Resistor: CompType: CR-05FL7---2K7; Distributor: Lomex; Order Code: 80-10-91; Package: 0805; Part Class: Resistor; Value: 2k7 1%
R43 R46 = Resistor: CompType: CR-05FL7---2K4; Distributor: Lomex; Order Code: 80-14-00; Package: 0805; Part Class: Resistor
  R43: Value: 1K8 1%
  R46: Value: 1k8 1%
U4 U5 U7 U8 = FAN4174IS5X: OrderCode: 671-1166; CompType: FAN4174IS5X; Distributor: RS components; Package: SOT-23-5
U6 = LM2903D: komparátor
U9 = ASC711: Árammérő

## Sheet ftdi_ok.SchDoc
size A3; DocumentNumber: 5; SheetNumber: 5; SheetTotal: 6
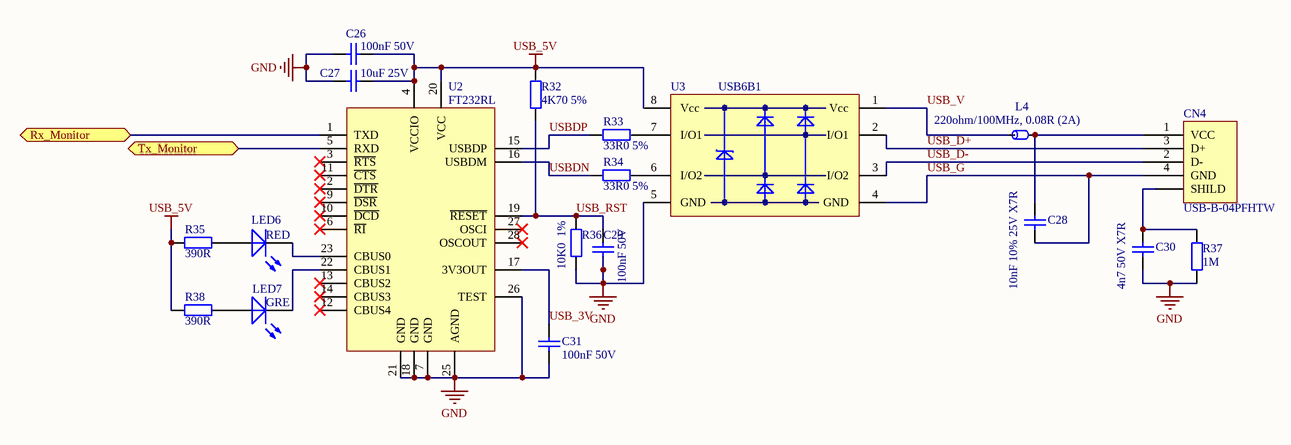
[diagram p5: ftdi_ok.SchDoc]

### Parts
C26  100nF 50V  [0805_C]
C27  10uF 25V  [1206_C]
C28  10nF 10% 25V X7R  [1210_C]
C29  100nF 50V  [0805_C]
C30  4n7 50V X7R  [0805_C]
C31  100nF 50V  [0805_C]
CN4  USB-B-04PFHTW  [USB-B]
L4  220ohm/100MHz, 0.08R (2A)  [0805_R]
LED6  RED  [FP_LED_TH_RED]
LED7  GRE  [FP_LED_TH_GREEN]
R32  4K70 5%  [AXIAL-0.3]
R33  33R0 5%  [AXIAL-0.3]
R34  33R0 5%  [AXIAL-0.3]
R35  390R  [AXIAL-0.3]
R36  10K0  1%  [AXIAL-0.3]
R37  1M  [0805_R]
R38  390R  [AXIAL-0.3]
U2  FT232RL  [SSOP-28]
U3  USB6B1  [SO-8]

### Ports
Rx_Monitor, Tx_Monitor

### Nets
GND: C26.2 C27.2 C29.2 C30.2 C31.2 R36.1 R37.2 U2.7(GND) U2.18(GND) U2.21(GND) U2.25(AGND) U2.26(TEST) U3.5(GND)
USB_5V: C26.1 C27.1 R32.2 R35.1 R38.1 U2.4(VCCIO) U2.20(VCC) U3.8(Vcc)
USB_3V: C31.1 U2.17(3V3OUT)
USB_D+: CN4.3(D+) U3.2(I/O1)
USB_D-: CN4.2(D-) U3.3(I/O2)
USB_G: C28.2 CN4.4(GND) U3.4(GND)
USB_RST: C29.1 R32.1 R36.2 U2.19(~{RESET})
USB_V: L4.2 U3.1(Vcc)
USBDN: R34.2 U2.16(USBDM)
USBDP: R33.2 U2.15(USBDP)
NetC28_1: C28.1 CN4.1(VCC) L4.1
NetC30_1: C30.1 CN4.0(SHILD) R37.1
NetLED6_1: LED6.1(A) R35.2
NetLED6_2: LED6.2(K) U2.23(CBUS0)
NetLED7_1: LED7.1(A) R38.2
NetLED7_2: LED7.2(K) U2.22(CBUS1)
NetP1_1: U2.5(RXD) ; port Tx_Monitor
NetP1_48: U2.1(TXD) ; port Rx_Monitor
NetR33_1: R33.1 U3.7(I/O1)
NetR34_1: R34.1 U3.6(I/O2)

Not connected (* = marked no-connect by the designer): U2 2(~{DTR})* 3(~{RTS})* 6(~{RI})* 9(~{DSR})* 10(~{DCD})* 11(~{CTS})* 12(CBUS4)* 13(CBUS2)* 14(CBUS3)* 27(OSCI)* 28(OSCOUT)*

### Library data of the parts
C26 C29 C31 = Capacitor_SMD: as C34 on sheet Measurements; Distributor: Lomex; Order Code: 82-07-32; Package: 0805; Part Class: Capacitor; Value: 100nF 50V
C27 = Capacitor_SMD: SMD kondenzátorok; K_Manufacturer: (SAM); CompType: CL31A106KAHNNNE; Note: 10% X5R; Distributor: Lomex; Order Code: 82-07-90; Package: 1206; Part Class: Capacitor; Value: 10uF 25V
C28 = Capacitor_SMD: SMD kondenzátorok; CompType: CC0805KRX7R8BB103; Distributor: Lomex; Order Code: 82-05-66; Package: 0805; Part Class: Capacitor; Value: 10nF 10% 25V X7R
C30 = Capacitor_SMD: as C5 on sheet UPS_controller; Distributor: Lomex; Order Code: 82-00-71; Package: 0805; Part Class: Capacitor; Value: 4n7 50V X7R
CN4 = USB-B: as CN1 on sheet UPS_controller; Distributor: Lomex; Order Code: 43-14-75; Package: USB-B 4P ANYA 90°; Price: 80; CompType: USB-B-04PFHTW
L4 = Ferrit Bead: SMD Ferrit Bead 220ohm/100MHz; Part Class: Inductivity; CompType: CB05YTYH221; Distributor: Lomex; Order Code: 93-03-48; Package: 0805; Value: 220ohm/100MHz, 0.08R (2A)
LED6 = LED: as LED1 on sheet Processor; Distributor: Lomex; Order Code: 95-00-28; Package: 1206; Value: RED
LED7 = LED: as LED2 on sheet Processor; Distributor: Lomex; Order Code: 95-00-26; Package: 1206; Value: GRE
R32 = Resistor: K_Manufacturer: Viking Tech Corp.; CompType: CR-05JL7---4K7; Distributor: Lomex; Order Code: 81-10-95; Package: 0805; Part Class: Resistor; Value: 4K70 5%
R33 R34 = Resistor: K_Manufacturer: Viking Tech Corp.; CompType: CR-05JL7---33R; Note: 0.125W; Distributor: Lomex; Order Code: 81-10-69; Package: 0805; Part Class: Resistor; Value: 33R0 5%
R35 R38 = Resistor: as R27 on sheet Processor; Distributor: Lomex; Order Code: 81-10-82; Package: 0805; Part Class: Resistor; Value: 390R
R36 = Resistor: K_Manufacturer: Viking Tech Corp.; CompType: CR-05FL7---10K; Distributor: Lomex; Order Code: 80-10-98; Package: 0805; Part Class: Resistor; Value: 10K0  1%
R37 = Resistor: K_Manufacturer: Viking Tech Corp.; CompType: CR-05JL7----1M; K_Note: 0.125W; K_Tolarence: 5%; Distributor: Lomex; Order Code: 81-11-22; Package: 0805; Part Class: Resistor; Value: 1M; K_Description: Resistor; K_Value: 1M; Mounted: Yes; SMD: Yes
U2 = FT232RL: USB - UART IC; K_Manufacturer: (FTD); Note: USB UART IC; CompType: FT232RL; Distributor: Lomex; Order Code: 89-21-46; Package: SSOP-28; Part Class: IC
U3 = USB6B1: Note: TVS diode; Order Code: 687-1075; CompType: USB6B1; Distributor: RS components; Package: SOIC-8; Part Class: TVS diode

## Nets that join several sheets
GND: Processor (38 pins), BufferDriver (13 pins), FetController (7 pins), UPS_controller (19 pins), Measurements (33 pins), ftdi_ok (13 pins)
VBATT: Processor (D3.2), UPS_controller (C9.2 F2.2 R21.1 TP11.1), Measurements (U9.3 U9.4)
VCPU: Processor (7 pins), BufferDriver (U?.1), Measurements (6 pins)
VDDA: Processor (C13.2 C15.1 L3.2 P1.11), Measurements (10 pins)
VDRV: Processor (8 pins), FetController (C3.2 C4.2 Q5.2)
VIN: Processor (D2.2), UPS_controller (6 pins)
VMUV: Processor (C23.2 Q14.2), BufferDriver (C10.2 Q11.20)
NetC1_1: FetController (6 pins), UPS_controller (L1.1 Q9.3 Q10.2)
NetC7_1: FetController (D1.2), UPS_controller (7 pins)
NetC40_2: Processor (P1.10), Measurements (5 pins)
NetC41_2: Processor (P1.9), Measurements (5 pins)
NetC50_2: Processor (P1.8), Measurements (C50.2 R65.1 U7.1)
NetC51_2: Processor (P1.7), Measurements (C51.2 R66.1 U8.1)
NetL1_2: UPS_controller (L1.2), Measurements (U9.1 U9.2)
NetP1_1: Processor (P1.1), ftdi_ok (U2.5)
NetP1_26: Processor (P1.26), Measurements (R49.1 U6.1)
NetP1_27: Processor (P1.27), Measurements (R56.1 U6.7)
NetP1_28: Processor (P1.28 R23.1 TP12.1), BufferDriver (Q11.4)
NetP1_29: Processor (P1.29 R24.2 TP13.1), BufferDriver (Q11.2)
NetP1_37: Processor (P1.37 TP14.1), BufferDriver (Q11.6)
NetP1_47: Processor (P1.47), Measurements (R67.1 U9.7)
NetP1_48: Processor (P1.48), ftdi_ok (U2.1)
NetQ9_1: FetController (R3.2 R4.2 TP2.1), UPS_controller (Q9.1)
NetQ10_1: FetController (R9.2 R10.2 TP6.1), UPS_controller (Q10.1)
NetQ11_14: BufferDriver (Q11.14), UPS_controller (R19.1 TP10.1)
NetQ11_16: BufferDriver (Q11.16), FetController (R8.2 TP5.1)
NetQ11_18: BufferDriver (Q11.18), FetController (R6.2 TP3.1)
NetR13_2: UPS_controller (R13.2), Measurements (R62.1)
NetR15_1: UPS_controller (R15.1), Measurements (R41.1)
NetR16_1: UPS_controller (R16.1), Measurements (R61.1)
NetR18_2: UPS_controller (R18.2), Measurements (R44.1)
NetR21_2: UPS_controller (R21.2), Measurements (R43.2)
NetR22_2: UPS_controller (R22.2), Measurements (R46.2)